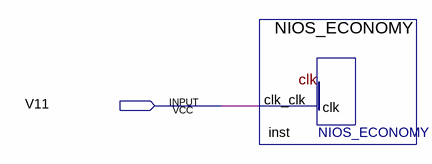
[diagram p0: schematic sheet]
// Quartus schematic nios_proj.bdf as structural Verilog: 1 symbols, 1 pins
module nios_proj (
  input  V11
);

  NIOS_ECONOMY inst (.clk_clk(V11));
endmodule
